# Altium schematic sheet VUE_PIC32_v1_0_Signals.SchDoc: [VUE32 - Digital I/Os]
size A4; Engineer: JFDuval; Revision: 1.0
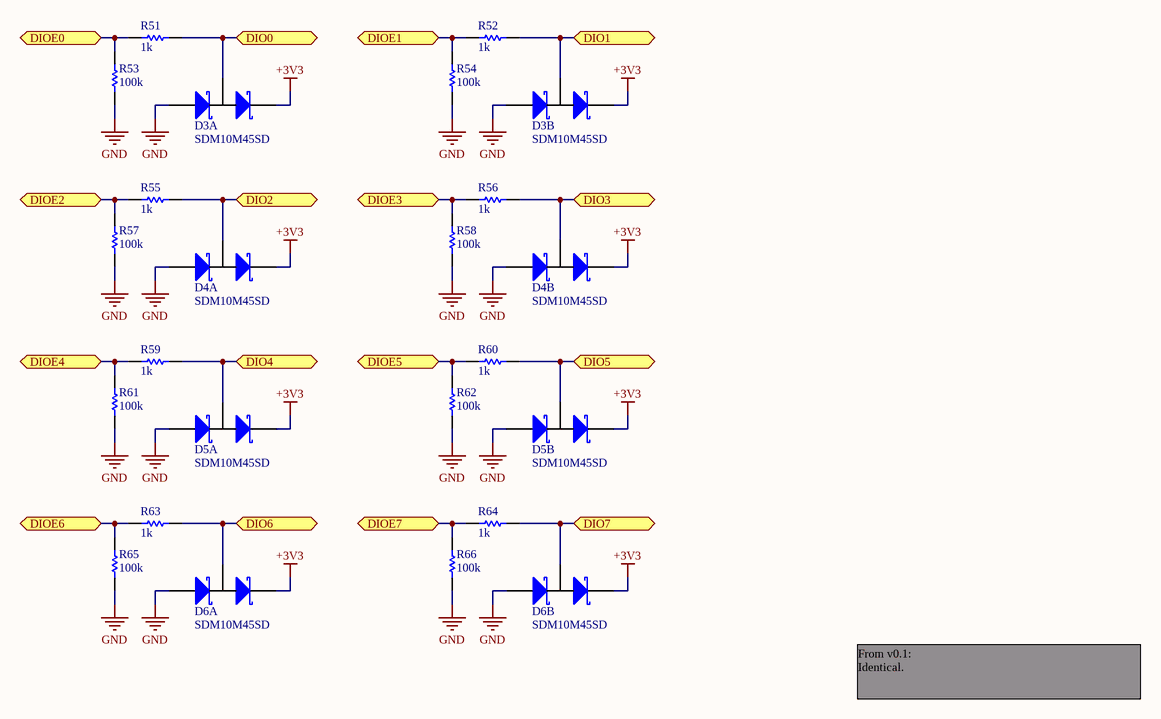
[diagram p0: VUE_PIC32_v1_0_Signals.SchDoc]

## Parts
D3  SDM10M45SD  [SOT23-6]  (parts A,B of 2)
D4  SDM10M45SD  [SOT23-6]  (parts A,B of 2)
D5  SDM10M45SD  [SOT23-6]  (parts A,B of 2)
D6  SDM10M45SD  [SOT23-6]  (parts A,B of 2)
R51  1k  [0402]
R52  1k  [0402]
R53  100k  [0402]
R54  100k  [0402]
R55  1k  [0402]
R56  1k  [0402]
R57  100k  [0402]
R58  100k  [0402]
R59  1k  [0402]
R60  1k  [0402]
R61  100k  [0402]
R62  100k  [0402]
R63  1k  [0402]
R64  1k  [0402]
R65  100k  [0402]
R66  100k  [0402]

## Ports
DIO0 (bidir), DIO1 (bidir), DIO2 (bidir), DIO3 (bidir), DIO4 (bidir), DIO5 (bidir), DIO6 (bidir), DIO7 (bidir), DIOE0 (bidir), DIOE1 (bidir), DIOE2 (bidir), DIOE3 (bidir), DIOE4 (bidir), DIOE5 (bidir), DIOE6 (bidir), DIOE7 (bidir)

## Nets
+3V3: D3.2(K) D3.5(K) D4.2(K) D4.5(K) D5.2(K) D5.5(K) D6.2(K) D6.5(K)
GND: D3.1(A) D3.4(A) D4.1(A) D4.4(A) D5.1(A) D5.4(A) D6.1(A) D6.4(A) R53.1 R54.1 R57.1 R58.1 R61.1 R62.1 R65.1 R66.1
DIO0: D3.6(M) R51.2 ; port DIO0
DIO1: D3.3(M) R52.2 ; port DIO1
DIO2: D4.6(M) R55.2 ; port DIO2
DIO3: D4.3(M) R56.2 ; port DIO3
DIO4: D5.6(M) R59.2 ; port DIO4
DIO5: D5.3(M) R60.2 ; port DIO5
DIO6: D6.6(M) R63.2 ; port DIO6
DIO7: D6.3(M) R64.2 ; port DIO7
DIOE0: R51.1 R53.2 ; port DIOE0
DIOE1: R52.1 R54.2 ; port DIOE1
DIOE2: R55.1 R57.2 ; port DIOE2
DIOE3: R56.1 R58.2 ; port DIOE3
DIOE4: R59.1 R61.2 ; port DIOE4
DIOE5: R60.1 R62.2 ; port DIOE5
DIOE6: R63.1 R65.2 ; port DIOE6
DIOE7: R64.1 R66.2 ; port DIOE7

## Notes on the sheet
- From v0.1:
  Identical.

## Library data of the parts
D3-D6 = DIODE_DIODESINC_SDM10M45SD_QUAD_SCHOTTKY_45V_200MA: DIODE SCHOTTKY ARRAY 45V SOT26; MfgPartNumber: SDM10M45SD-7-F; Mfg: Diodes Inc; Value: SDM10M45SD; Digikey: SDM10M45SD-FDICT-ND
R51 R52 R55 R56 R59 R60 R63 R64 = RES_YAGEO_0402_1K_1PCT: RES 1.00K OHM 1/16W 1% 0402 SMD; MfgPartNumber: RC0402FR-071KL; Mfg: Yageo; Value: 1k; Digikey: 311-1.00KLRCT-ND
R53 R54 R57 R58 R61 R62 R65 R66 = RES_YAGEO_0402_100K_1PCT: RES 100K OHM 1/16W 1% 0402 SMD; MfgPartNumber: RC0402FR-07100KL; Mfg: Yageo; Value: 100k; Digikey: 311-100KLRCT-ND